# Altium schematic sheet USB_SWITCH.SchDoc
size 420 x 297 mm; SheetNumber: 16; SheetTotal: 32
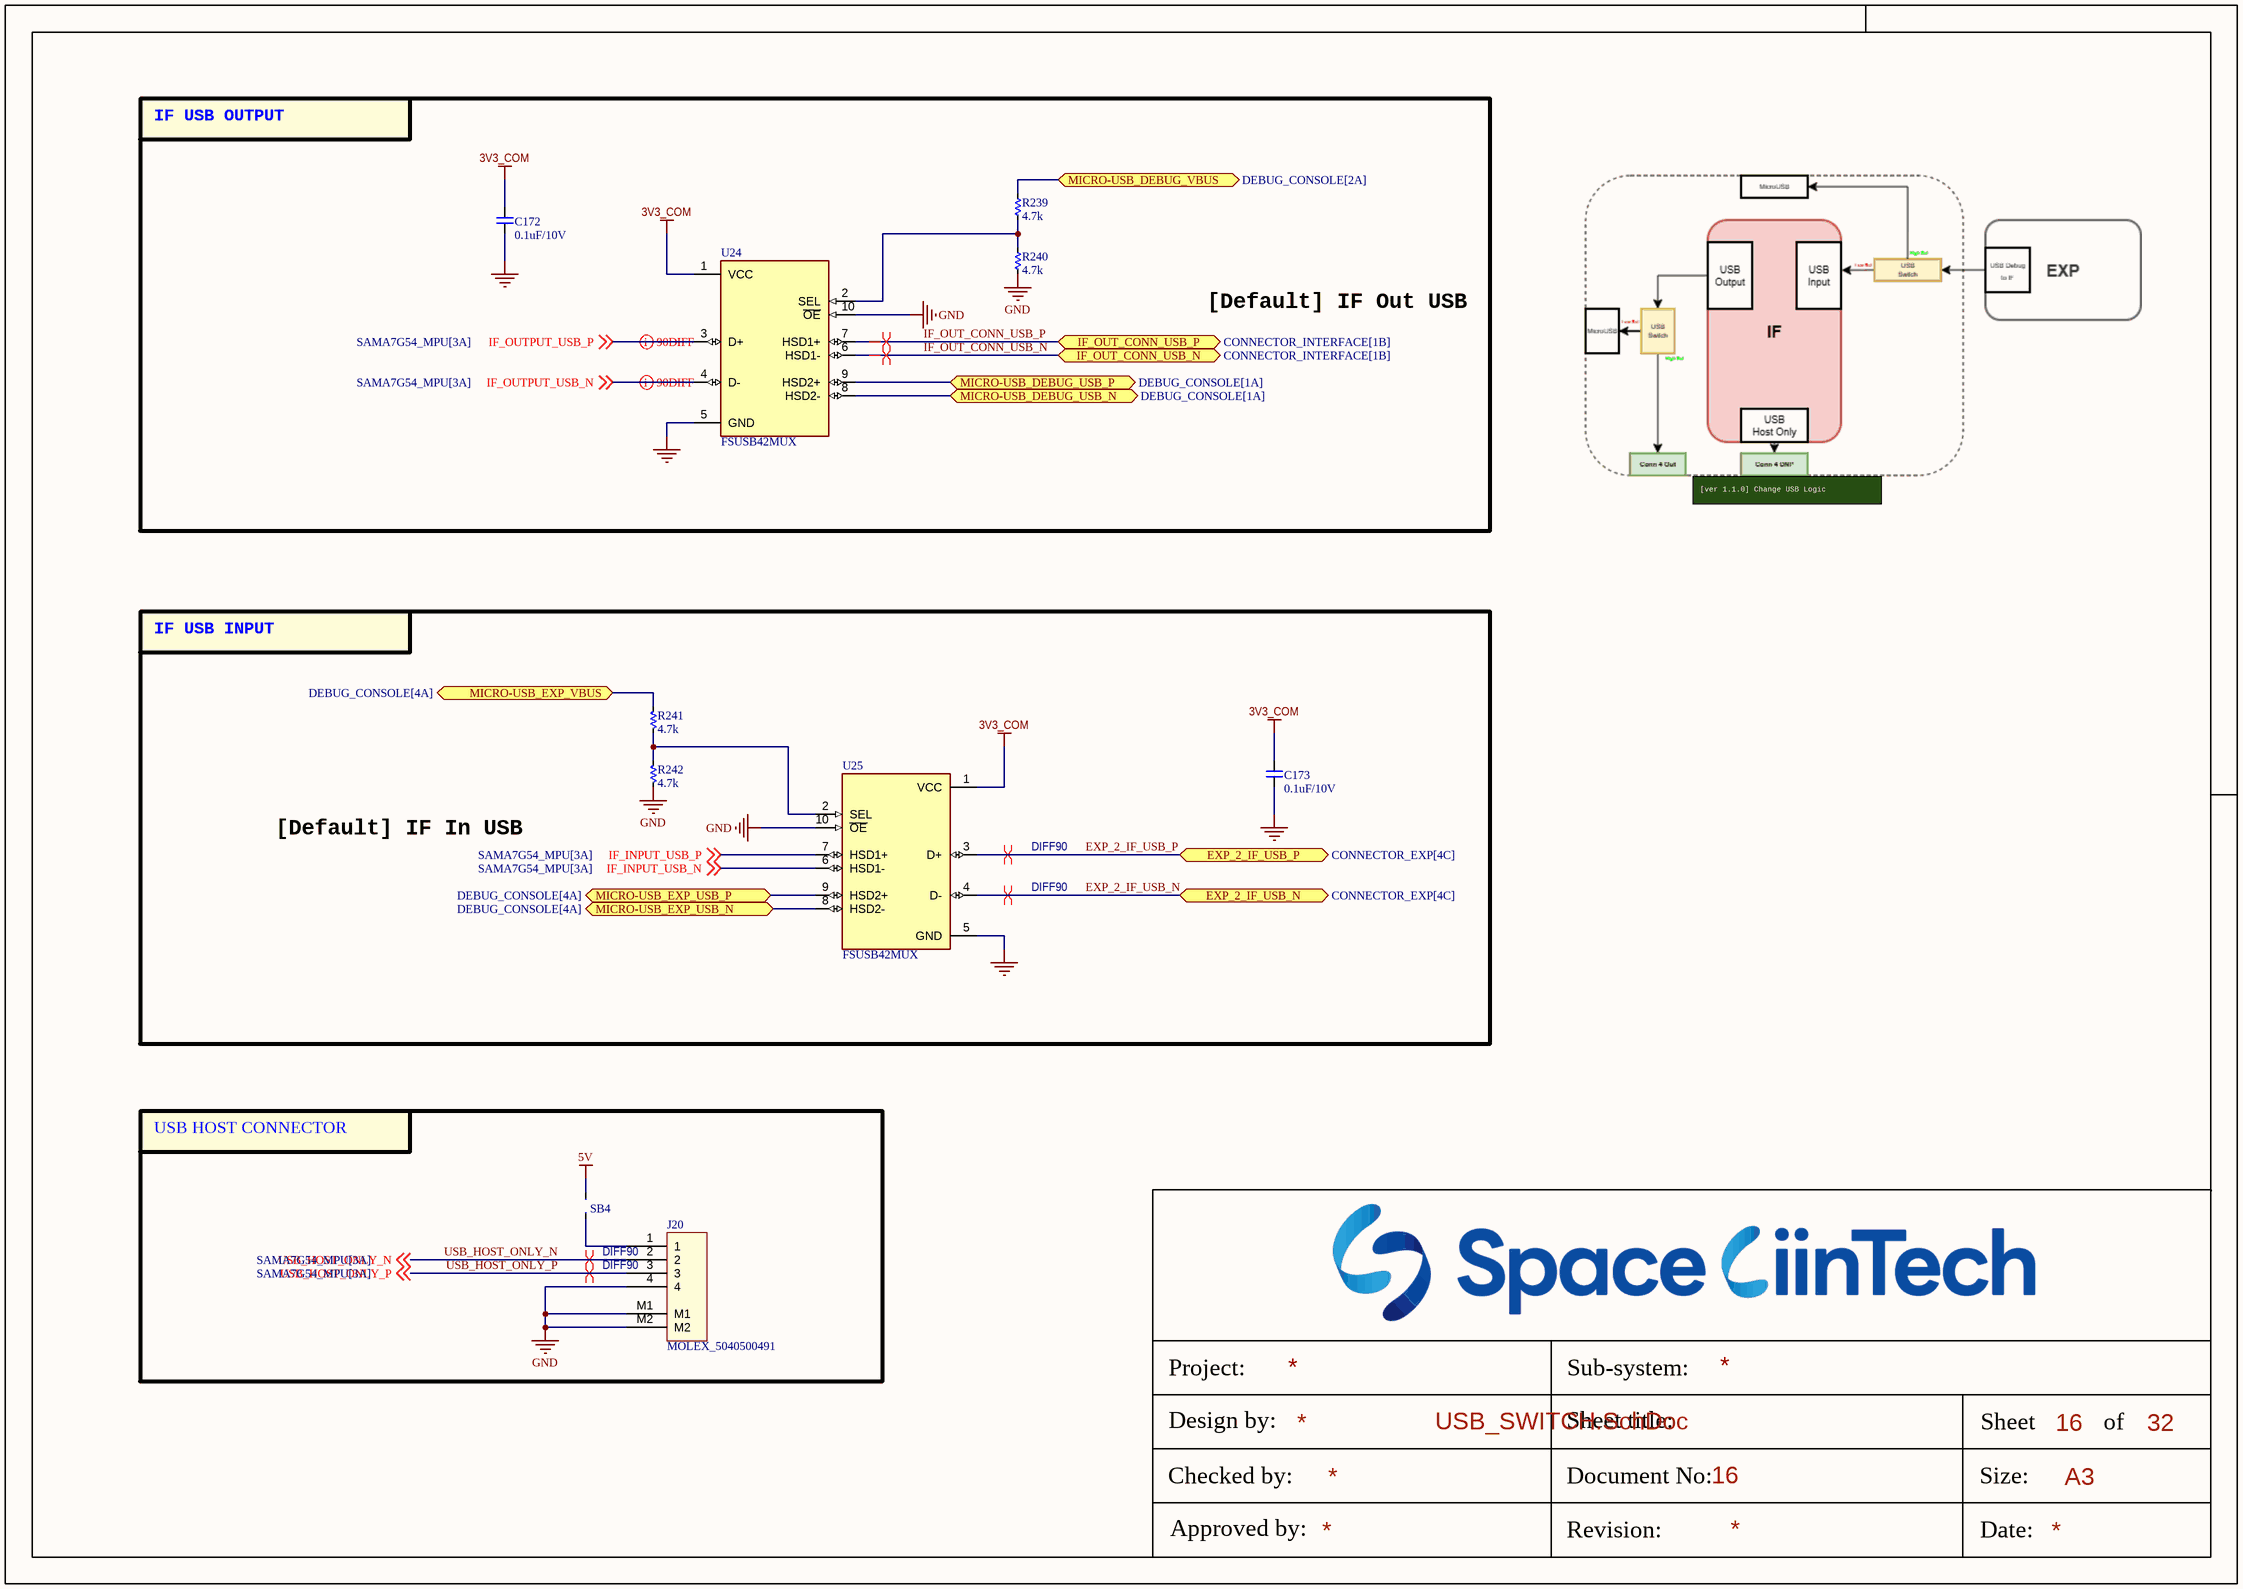
[diagram p0: USB_SWITCH.SchDoc]

## Parts
C172  0.1uF/10V  [CAP_C_1005X50_L]
C173  0.1uF/10V  [CAP_C_1005X50_L]
J20  MOLEX_5040500491  [MOLEX_5040500491]
R239  4.7k  [RES_C_1005x30_L]
R240  4.7k  [RES_C_1005x30_L]
R241  4.7k  [RES_C_1005x30_L]
R242  4.7k  [RES_C_1005x30_L]
SB4  JUMPER  [JUMPER_1608]  (value not drawn)
U24  FSUSB42MUX  [SOP50P490X110-10N]
U25  FSUSB42MUX  [SOP50P490X110-10N]

## Blocks framed on the sheet
[Default] IF Out USB: C172 R239 R240 U24
[Default] IF In USB: C173 R241 R242 U25
USB HOST CONNECTOR: J20 SB4

## Ports
EXP_2_IF_USB_N (bidir, see CONNECTOR_EXP[4C]), EXP_2_IF_USB_P (bidir, see CONNECTOR_EXP[4C]), IF_OUT_CONN_USB_N (bidir, see CONNECTOR_INTERFACE[1B]), IF_OUT_CONN_USB_P (bidir, see CONNECTOR_INTERFACE[1B]), MICRO-USB_DEBUG_USB_N (bidir, see DEBUG_CONSOLE[1A]), MICRO-USB_DEBUG_USB_P (bidir, see DEBUG_CONSOLE[1A]), MICRO-USB_DEBUG_VBUS (bidir, see DEBUG_CONSOLE[2A]), MICRO-USB_EXP_USB_N (bidir, see DEBUG_CONSOLE[4A]), MICRO-USB_EXP_USB_P (bidir, see DEBUG_CONSOLE[4A]), MICRO-USB_EXP_VBUS (bidir, see DEBUG_CONSOLE[4A])

## Nets
3V3_COM: C172.2 C173.2 U24.1(VCC) U25.1(VCC)
5V: SB4.1
GND: C172.1 C173.1 J20.4 J20.M1 J20.M2 R240.2 R242.2 U24.5(GND) U24.10(~{OE}) U25.5(GND) U25.10(~{OE})
EXP_2_IF_USB_N: U25.4(D-) ; port EXP_2_IF_USB_N
EXP_2_IF_USB_P: U25.3(D+) ; port EXP_2_IF_USB_P
IF_INPUT_USB_N: U25.6(HSD1-) ; off-sheet IF_INPUT_USB_N
IF_INPUT_USB_P: U25.7(HSD1+) ; off-sheet IF_INPUT_USB_P
IF_OUT_CONN_USB_N: U24.6(HSD1-) ; port IF_OUT_CONN_USB_N
IF_OUT_CONN_USB_P: U24.7(HSD1+) ; port IF_OUT_CONN_USB_P
IF_OUTPUT_USB_N: U24.4(D-) ; off-sheet IF_OUTPUT_USB_N
IF_OUTPUT_USB_P: U24.3(D+) ; off-sheet IF_OUTPUT_USB_P
MICRO-USB_DEBUG_USB_N: U24.8(HSD2-) ; port MICRO-USB_DEBUG_USB_N
MICRO-USB_DEBUG_USB_P: U24.9(HSD2+) ; port MICRO-USB_DEBUG_USB_P
MICRO-USB_DEBUG_VBUS: R239.1 ; port MICRO-USB_DEBUG_VBUS
MICRO-USB_EXP_USB_N: U25.8(HSD2-) ; port MICRO-USB_EXP_USB_N
MICRO-USB_EXP_USB_P: U25.9(HSD2+) ; port MICRO-USB_EXP_USB_P
MICRO-USB_EXP_VBUS: R241.1 ; port MICRO-USB_EXP_VBUS
USB_HOST_ONLY_N: J20.2 ; off-sheet USB_HOST_ONLY_N
USB_HOST_ONLY_P: J20.3 ; off-sheet USB_HOST_ONLY_P
NetJ20_1: J20.1 SB4.2
NetR239_2: R239.2 R240.1 U24.2(SEL)
NetR241_2: R241.2 R242.1 U25.2(SEL)

## Layout directives
differential pair; differential pair class DIFF90; net class DIFF90: IF_OUTPUT_USB_N, IF_OUTPUT_USB_P
differential pair; differential pair class DIFF90; net class DIFF90; rule Matched Net Lengths [Tolerance = 4mil]: EXP_2_IF_USB_N, EXP_2_IF_USB_P, IF_OUT_CONN_USB_N, IF_OUT_CONN_USB_P, USB_HOST_ONLY_N, USB_HOST_ONLY_P

## Notes on the sheet
- IF USB OUTPUT
- [ver 1.1.0] Change USB Logic
- IF USB INPUT
- Project:
- Sub-system:
- Design by:
- Sheet title:
- Sheet
- A3
- of
- Checked by:
- Approved by:
- Revision:
- Document No:
- Size:
- Date:

## Library data of the parts
C172 C173 = _CAP_C_2: CAP
J20 = Header 4x1_2M
R239-R242 = _RES_B_2: RES
U24 U25 = FSUSB42MUX: FSUSB42 Series DPDT 4.3 V 480 Mbps SMT Hi Speed USB 2.0 Switch - MSOP-10; MF: ON Semiconductor; SnapEDA_Link: https://www.snapeda.com/parts/FSUSB42MUX/Onsemi/view-part/?ref=snap; Package: MSOP-10 ON Semiconductor; Value: *; MP: FSUSB42MUX; Check_prices: https://www.snapeda.com/parts/FSUSB42MUX/Onsemi/view-part/?ref=eda